# Altium schematic sheet revised_component_layout.SchDoc
size A4; SheetNumber: 1; SheetTotal: 1
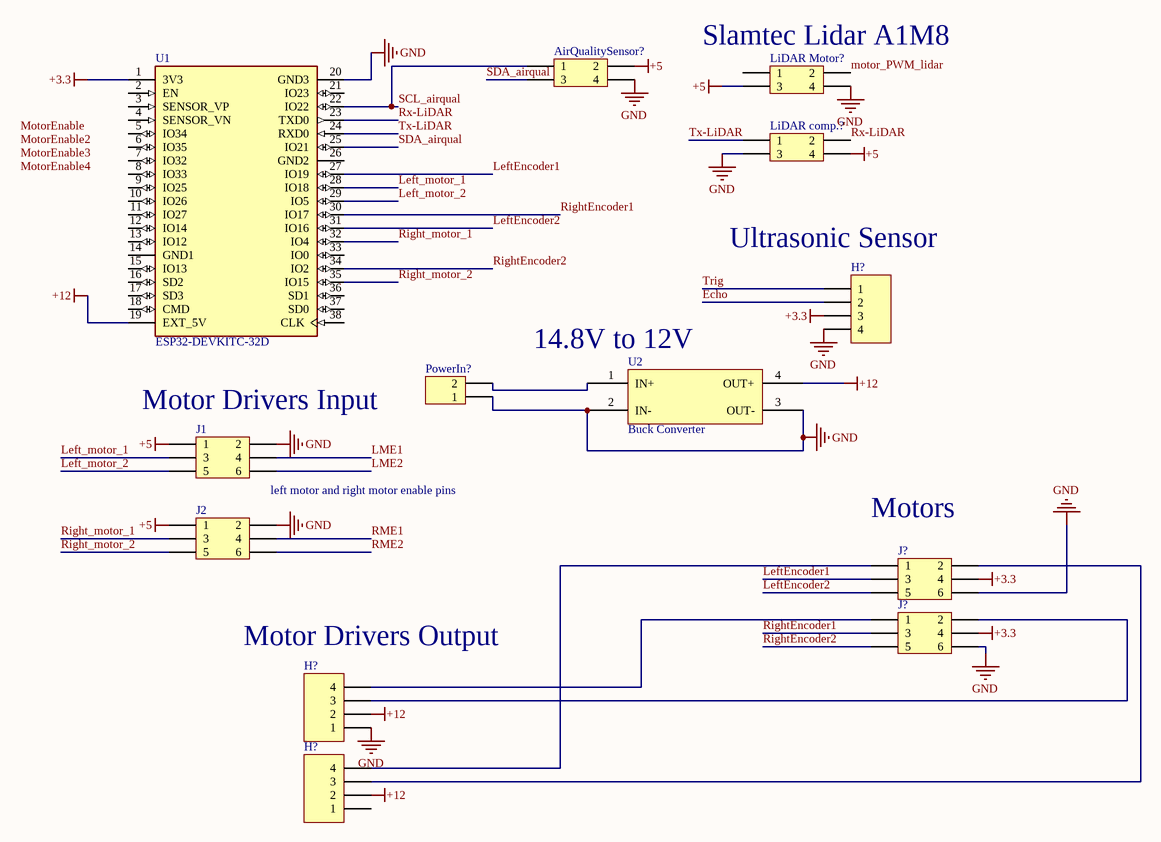
[diagram p0: revised_component_layout.SchDoc]

## Parts
(Parts that share a designator on the sheet are numbered #1, #2 ... from top to bottom, then left to right.)
AirQualitySensor?  HEADER  [HDR2X2]  (value not drawn)
H?#1  Header 4  [HDR1X4]  (value not drawn)
H?#2  Header 4  [HDR1X4]  (value not drawn)
H?#3  Header 4  [HDR1X4]  (value not drawn)
J1  HEADER  [HDR2X3]  (value not drawn)
J2  HEADER  [HDR2X3]  (value not drawn)
J?#1  HEADER  [HDR2X3]  (value not drawn)
J?#2  HEADER  [HDR2X3]  (value not drawn)
LiDAR_comp.?  HEADER  [HDR2X2]  (value not drawn)
LiDAR_Motor?  HEADER  [HDR2X2]  (value not drawn)
PowerIn?  Header 2  [HDR1X2]  (value not drawn)
U1  ESP32-DEVKITC-32D  [MODULE_ESP32-DEVKITC-32D]
U2  Buck Converter  [Buck Converter]

## Nets
+3.3: H?#1.3 J?#1.4 J?#2.4 U1.1(3V3)
+5: AirQualitySensor?.2 J1.1 J2.1 LiDAR_comp.?.4 LiDAR_Motor?.3
+12: H?#2.2 H?#3.2 U1.19(EXT_5V) U2.4(OUT+)
GND: AirQualitySensor?.4 H?#1.4 H?#2.1 J1.2 J2.2 J?#1.6 J?#2.6 LiDAR_comp.?.3 LiDAR_Motor?.4 PowerIn?.1 U1.20(GND3) U2.2(IN-) U2.3(OUT-)
Echo: H?#1.2
Left_motor_1: J1.3 U1.28(IO18)
Left_motor_2: J1.5 U1.29(IO5)
LeftEncoder1: J?#1.3 U1.27(IO19)
LeftEncoder2: J?#1.5 U1.31(IO16)
LME1: J1.4
LME2: J1.6
motor_PWM_lidar: LiDAR_Motor?.2
Right_motor_1: J2.3 U1.32(IO4)
Right_motor_2: J2.5 U1.35(IO15)
RightEncoder1: J?#2.3 U1.30(IO17)
RightEncoder2: J?#2.5 U1.34(IO2)
RME1: J2.4
RME2: J2.6
Rx-LiDAR: LiDAR_comp.?.2 U1.23(TXD0)
SCL_airqual: AirQualitySensor?.1 U1.22(IO22)
SDA_airqual: AirQualitySensor?.3 U1.25(IO21)
Trig: H?#1.1
Tx-LiDAR: LiDAR_comp.?.1 U1.24(RXD0)
NetH?#2_3: H?#2.3 J?#2.2
NetH?#2_4: H?#2.4 J?#2.1
NetH?#3_3: H?#3.3 J?#1.2
NetH?#3_4: H?#3.4 J?#1.1
NetPowerIn?_2: PowerIn?.2 U2.1(IN+)

Not connected (* = marked no-connect by the designer): H?#3 1; LiDAR_Motor? 1; U1 2(EN) 3(SENSOR_VP) 4(SENSOR_VN) 5(IO34) 6(IO35) 7(IO32) 8(IO33) 9(IO25) 10(IO26) 11(IO27) 12(IO14) 13(IO12) 14(GND1) 15(IO13) 16(SD2) 17(SD3) 18(CMD) 21(IO23) 26(GND2) 33(IO0) 36(SD1) 37(SD0) 38(CLK)

## Notes on the sheet
- (near LiDAR_Motor?) Slamtec Lidar A1M8
- (near H?#1) Ultrasonic Sensor
- (near U2) 14.8V to 12V
- (near J1) Motor Drivers Input
- left motor and right motor enable pins
- (near J?#1) Motors
- (near H?#2) Motor Drivers Output
- Labels drawn without touching a wire or pin: MotorEnable, MotorEnable2, MotorEnable3, MotorEnable4

## Library data of the parts
AirQualitySensor? LiDAR_comp.? LiDAR_Motor? = Header 2x2: Header, 5-Pin, Dual row; Revision: 17-Jul-2002: Re-released for DXP Platform.; Publisher: Altium Limited
H?#1-H?#3 = Header 4: Header, 4-Pin; Manufacturer: Generic Components; Class: Connector
J1 J2 J?#1 J?#2 = Header 2x3: Header, 5-Pin, Dual row; Revision: 17-Jul-2002: Re-released for DXP Platform.; Publisher: Altium Limited
PowerIn? = Header 2: Header, 2-Pin; Manufacturer: Generic Components; Class: Connector
U1 = ESP32-DEVKITC-32D: WiFi Development Tools (802.11) ESP32 General Development Kit, ESP32-WROOM-32D on the board; MF: Espressif Systems; Price: None; Availability: In Stock; MP: ESP32-DEVKITC-32D; Package: None; SnapEDA_Link: https://www.snapeda.com/parts/ESP32-DEVKITC-32D/Espressif+Systems/view-part/?ref=snap; Check_prices: https://www.snapeda.com/parts/ESP32-DEVKITC-32D/Espressif+Systems/view-part/?ref=eda; Value: *; Purchase-URL: https://pricing.snapeda.com/search/part/ESP32-DEVKITC-32D/?ref=eda
U2 = Buck Converter: Buck Convertor